# Altium schematic sheet 19_KEY_LED.SchDoc
size 246 x 182 mm
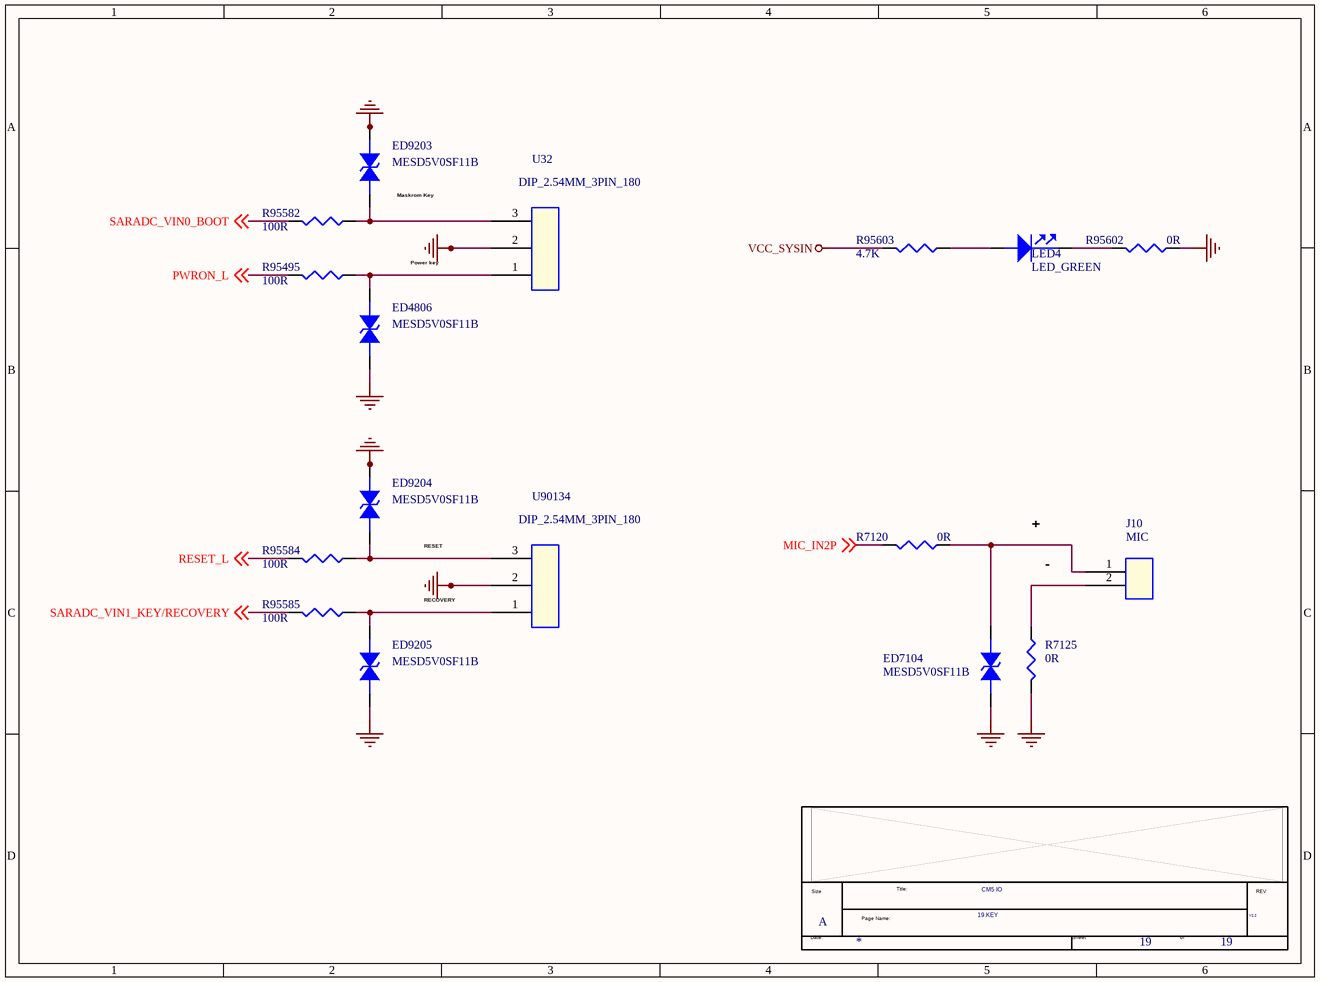
[diagram p0: 19_KEY_LED.SchDoc]

## Parts
*  Doc: 19.KEY  RevCode: V2.2  Title: CM5 IO  Page Size: A  Page Number: 19  (hidden comment: radxa_1010)  (graphical)
ED4806  MESD5V0SF11B  [E0402N]
ED7104  MESD5V0SF11B  [ESD0402]
ED9203  MESD5V0SF11B  [E0402N]
ED9204  MESD5V0SF11B  [E0402N]
ED9205  MESD5V0SF11B  [E0402N]
J10  MIC  [DIP2PIN-2P54MM]
LED4  LED_GREEN  [LED0603]
R7120  0R  [R0402]
R7125  0R  [R0402]
R95495  100R  [R0402]
R95582  100R  [R0402]
R95584  100R  [R0402]
R95585  100R  [R0402]
R95602  0R  [R0402]
R95603  4.7K  [R0402]
U32  DIP_2.54MM_3PIN_180  [DIP3_1X2P54]
U90134  DIP_2.54MM_3PIN_180  [DIP3_1X2P54]

## Nets
GND: ED4806.2 ED7104.2 ED9203.2 ED9204.2 ED9205.2 R7125.2 R95602.2 U32.2 U90134.2
VCC_SYSIN: R95603.1
MIC_IN2P: R7120.1 ; off-sheet MIC_IN2P
PWRON_L: R95495.1 ; off-sheet PWRON_L
RESET_L: R95584.1 ; off-sheet RESET_L
SARADC_VIN0_BOOT: R95582.1 ; off-sheet SARADC_VIN0_BOOT
SARADC_VIN1_KEY/RECOVERY: R95585.1 ; off-sheet SARADC_VIN1_KEY/RECOVERY
NetED4806_1: ED4806.1 R95495.2 U32.1
NetED7104_1: ED7104.1 J10.1 R7120.2
NetED9203_1: ED9203.1 R95582.2 U32.3
NetED9204_1: ED9204.1 R95584.2 U90134.3
NetED9205_1: ED9205.1 R95585.2 U90134.1
NetJ10_2: J10.2 R7125.1
NetLED4_1: LED4.1(ANODE) R95603.2
NetLED4_2: LED4.2(CATHODE) R95602.1

## Notes on the sheet
- (near ED9203) Maskrom Key
- Power key
- +
- RESET
- RECOVERY
- -
- (in symbol radxa_1010) Size; Title:; REV; Page Name:; Date:; Sheet; of

## Library data of the parts
ED4806 ED9203 = TVS: ESD Component,5V,30P,SMD,0402; BOM_TYPE: 40; BOM_VALUE: 0; PCB Footprint: E0402N
ED7104 = DIODE BI_DIR TRIG_2: 1-Line, Bi-directional, Transient Voltage Suppressors.17.5pF.; Manufacturer: WillSemi(韦尔半导体); RK PN: ESD5451N; Priority: A; PCB Footprint: ESD0402; Part Type: ESD_TVS; Manufacturer PN: ESD5451N; Created by: JJJ
ED9204 ED9205 = TVS: ESD Component,5V,30P,SMD,0402; BOM_VALUE: 0; BOM_TYPE: 40; PCB Footprint: E0402N
J10 = CON2: PCB Footprint: DIP2PIN-2P54MM
LED4 = LED: 贴片LED灯，0603，绿色; Priority: A; PCB Footprint: LED0603; Created by: JJJ; Part Type: LED; RK PN: LED_GREEN
R7120 = RESISTOR_1: 通用厚膜电阻,0R,+/-5%,R0402,1/16W.; Manufacturer PN: RC0402JR-070RL; Manufacturer: YAGEO; Tolerance: 5%; Wattage: 1/16W; Priority: A; PCB Footprint: R0402; Created by: YTL; Part Type: 通用厚膜电阻; RK PN: RC0402JR-070RL
R7125 = RESISTOR_1: 通用厚膜电阻,2K2,+/-1%,R0402,1/16W.; Manufacturer PN: RC0402FR-072K2L; Manufacturer: YAGEO; Tolerance: 1%; Wattage: 1/16W; Priority: A; PCB Footprint: R0402; Created by: YTL; Part Type: 通用厚膜电阻; RK PN: RC0402FR-072K2L
R95495 R95582 R95602 = RESISTOR_1_Dup1: 通用厚膜电阻,49K9,+/-1%,R0402,1/16W.; Manufacturer PN: RC0402FR-0749K9L; Manufacturer: YAGEO; Tolerance: 1%; Wattage: 1/16W; Priority: A; PCB Footprint: R0402; Created by: YTL; Part Type: 通用厚膜电阻; RK PN: RC0402FR-0749K9L
R95584 R95585 R95603 = RESISTOR_1_Dup1: 通用厚膜电阻,49K9,+/-1%,R0402,1/16W.; Manufacturer: YAGEO; Tolerance: 1%; RK PN: RC0402FR-0749K9L; Priority: A; Wattage: 1/16W; PCB Footprint: R0402; Part Type: 通用厚膜电阻; Manufacturer PN: RC0402FR-0749K9L; Created by: YTL
U32 U90134 = CON3_1: PCB Footprint: DIP3_1X2P54
* = radxa_1010: Page Create Date: March  8, 1995; Page Count: 19; Page Modify Date: *